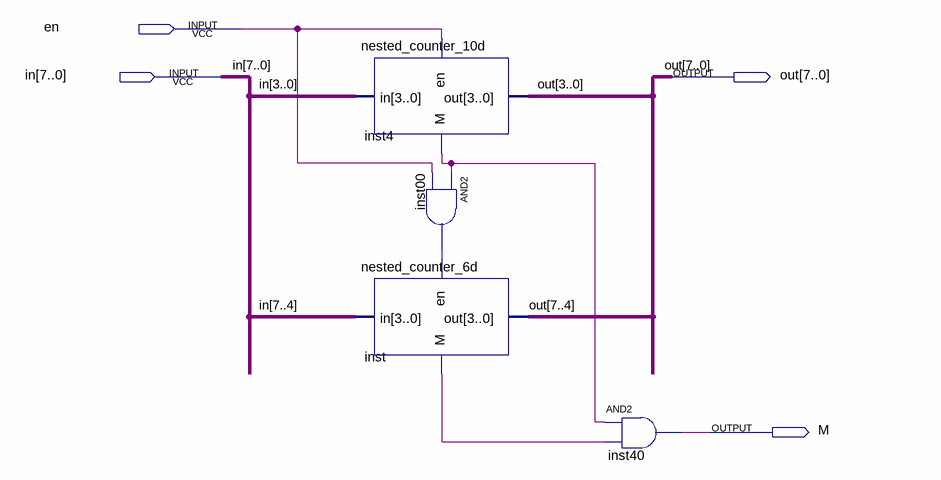
[diagram p0: schematic sheet]
// Quartus schematic nested_counter_60d.bdf as structural Verilog: 4 symbols, 4 pins
module nested_counter_60d (
  input  en,
  input  [7:0] in,
  output [7:0] out,
  output M
);

  wire inst00_out, inst4_m, inst_m;

  nested_counter_10d inst4 (.en(en), .in(in[3:0]), .out(out[3:0]), .M(inst4_m));
  and inst00 (inst00_out, inst4_m, en);
  nested_counter_6d inst (.en(inst00_out), .in(in[7:4]), .out(out[7:4]), .M(inst_m));
  and inst40 (M, inst4_m, inst_m);
endmodule
